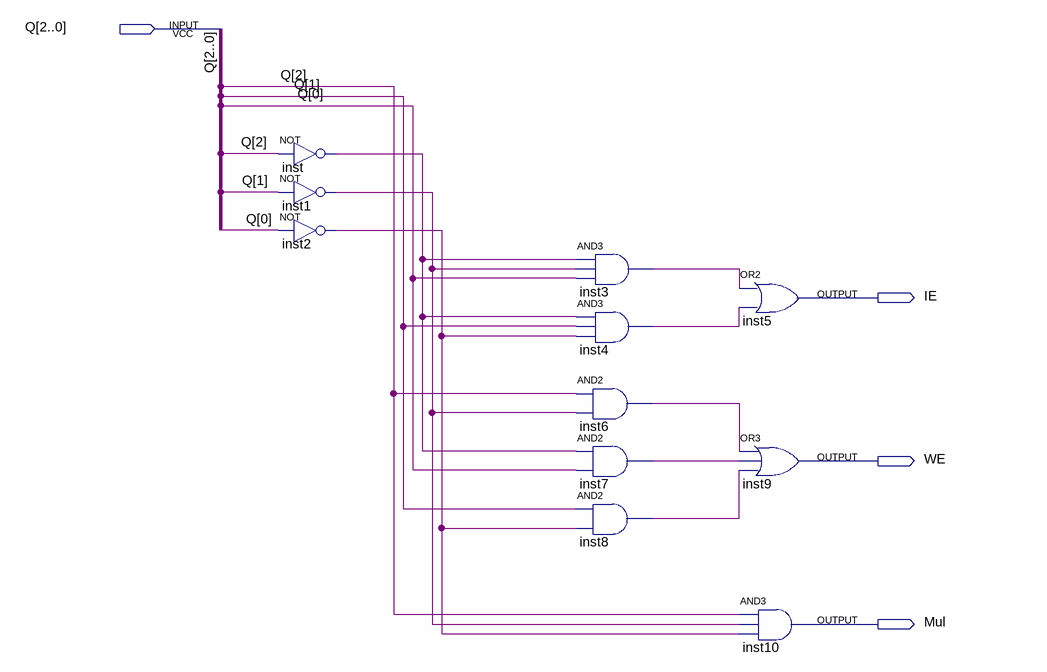
[diagram p0: schematic sheet]
// Quartus schematic IE_WE_Mul.bdf as structural Verilog: 11 symbols, 4 pins
module IE_WE_Mul (
  input  [2:0] Q,
  output IE,
  output WE,
  output Mul
);

  wire inst1_out, inst2_out, inst3_out, inst4_out, inst6_out, inst7_out, inst8_out, inst_out;

  not inst (inst_out, Q[2]);
  not inst1 (inst1_out, Q[1]);
  not inst2 (inst2_out, Q[0]);
  and inst3 (inst3_out, inst_out, inst1_out, Q[0]);
  and inst4 (inst4_out, inst_out, Q[1], inst2_out);
  and inst6 (inst6_out, Q[2], inst1_out);
  and inst7 (inst7_out, inst_out, Q[0]);
  and inst8 (inst8_out, Q[1], inst2_out);
  or inst5 (IE, inst3_out, inst4_out);
  or inst9 (WE, inst6_out, inst7_out, inst8_out);
  and inst10 (Mul, Q[2], inst1_out, inst2_out);
endmodule
